# EAGLE design G2G-X Module (EAGLE 7.2.0)
Grove-to-Gadgeteer Module
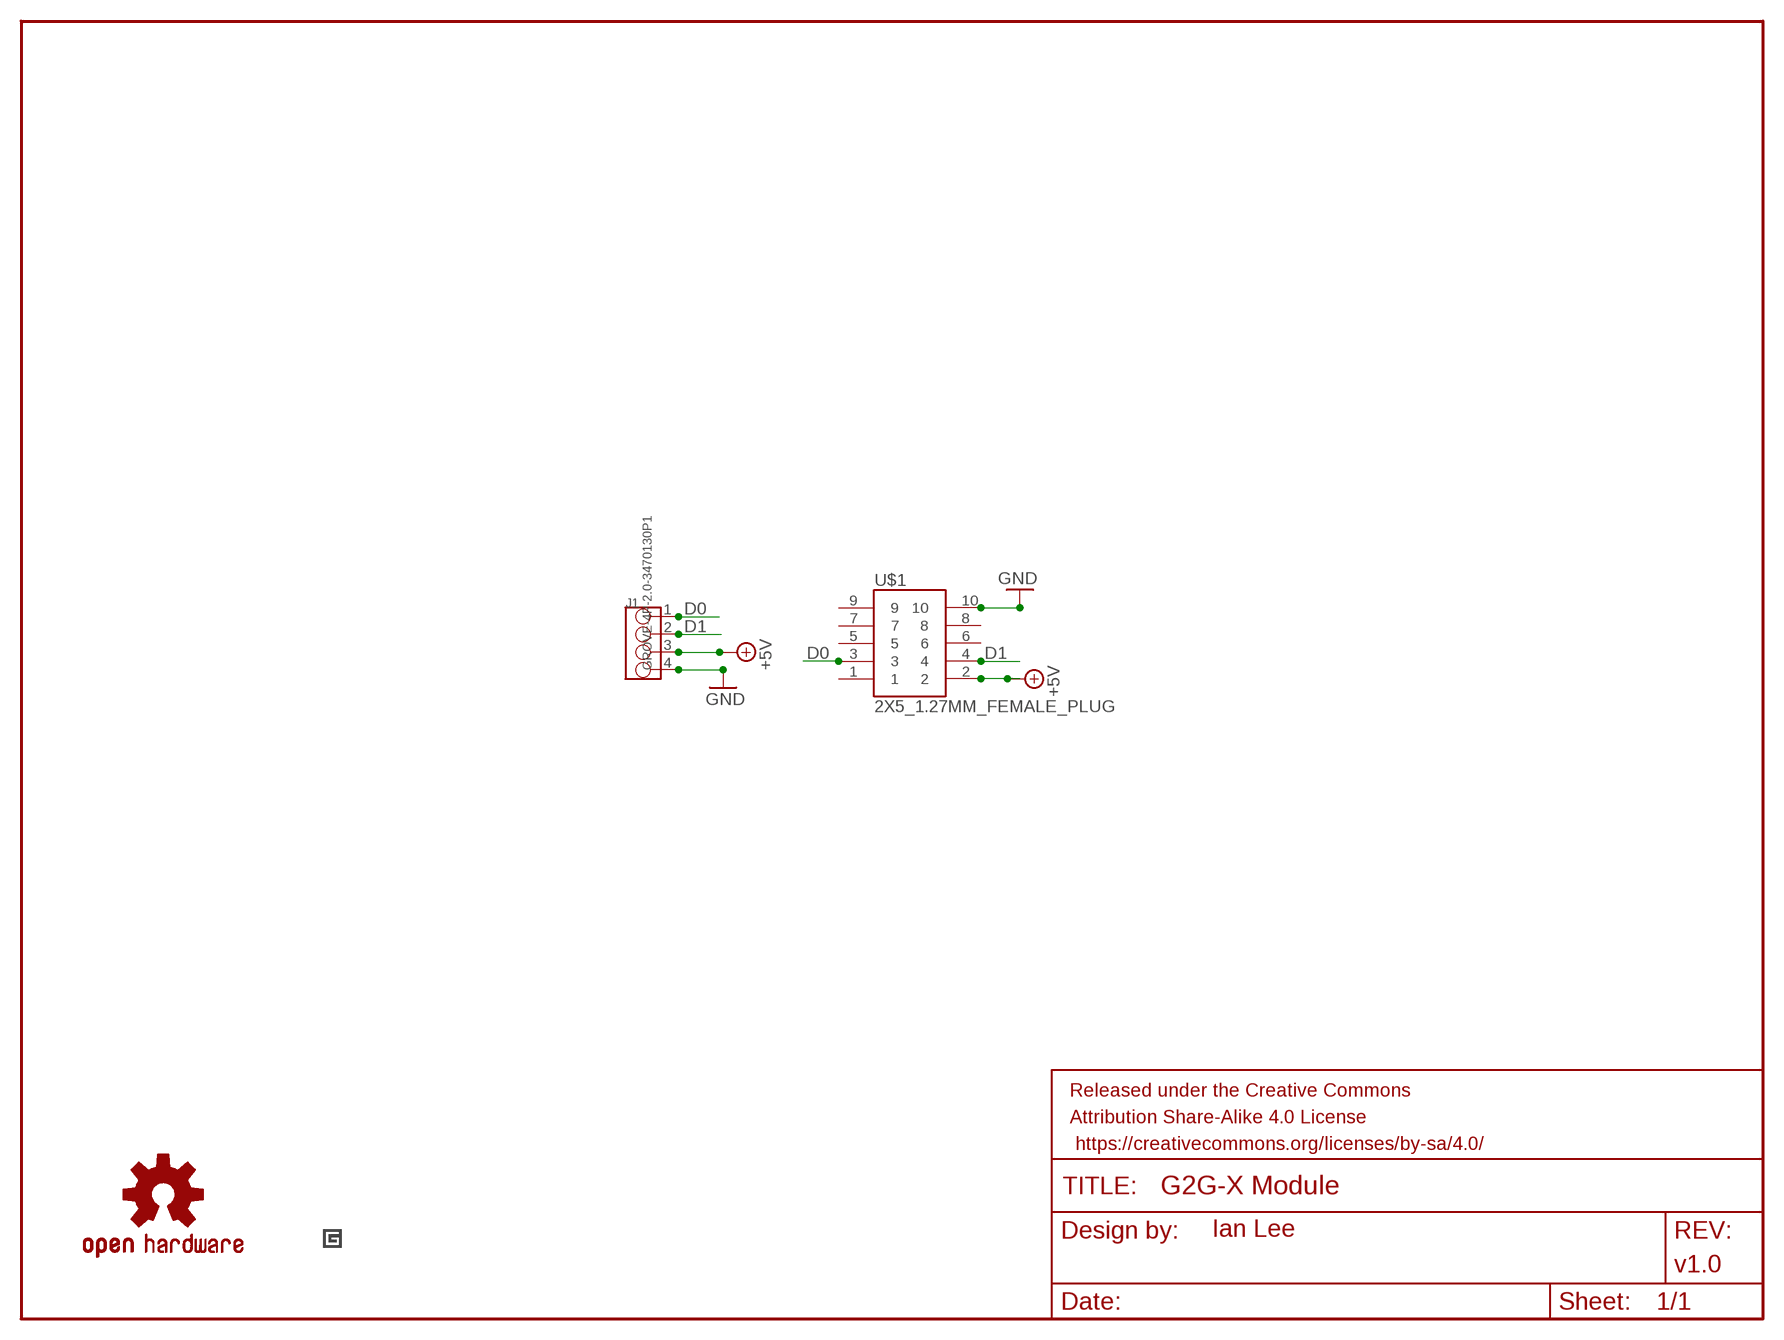
[diagram p0: schematic, sheet 1]

## Parts
FRAME1  FRAME-LETTERNO_PACKAGE  [DUMMY]
J1  GROVE-4P-2.0-3470130P1  [4P-2.0]
LOGO1  OSHW-LOGOS  [OSHW-LOGO-S]
U$1  2X5_1.27MM_FEMALE_PLUG  [2X5_1.27MM_FEMALE_PLUG]
U$2  GADGETEER_LOGO_SMALL  [GADGETEER_LOGO_SMALL]

## Nets
+5V: J1.3 U$1.2
D0: J1.1 U$1.3
D1: J1.2 U$1.4
GND: J1.4 U$1.10
Unconnected: U$1.1 U$1.5 U$1.6 U$1.7 U$1.8 U$1.9

## Library data of the parts
FRAME1 = SparkFun-Aesthetics:FRAME-LETTER: Schematic Frame Standard 8.5x11 US Letter frame; DESIGNER: Ian Lee; VERSION: v1.0
J1 = SoftDust:GROVE-4P-2.0
LOGO1 = SparkFun-Aesthetics:OSHW-LOGO: Open Source Hardware Logo This logo indicates the piece of hardware it is found on incorporates a OSHW license and/or adheres to the definition of open source hardware found here: http://freedomdefined.org/OSHW
U$1 = SoftDust:2X5_1.27MM_FEMALE_PLUG
U$2 = SoftDust:GADGETEER_LOGO_SMALL

## Board
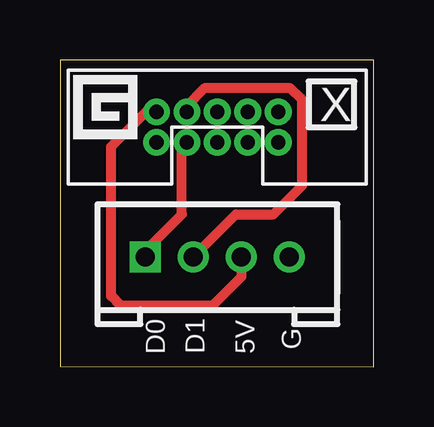
[diagram p1: board, top side]
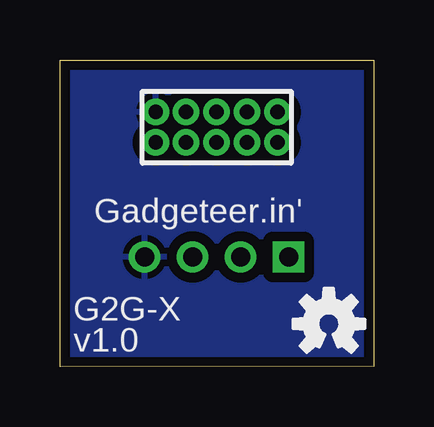
[diagram p2: board, bottom side, seen from below]

Size 13.08 x 12.8 mm. Coordinates in mm from the lower left corner, seen from the top.
Outline: 0,0.01 13.07,0 13.08,12.8 0,12.8 0,0.01
Copper layers (1*16): Top 0.035mm / dielectric 1.5mm / Bottom 0.035mm
Design rules "SeeedStudio_2layer_DRU_no_angle_20140221": minimum track width 6mil, minimum drill 12mil, track to track 6mil, track to pad 6mil, pad to pad 6mil, via to via 6mil, smd to smd 0mil, copper to edge 10mil, drill to drill 10mil, minimum pad ring 10mil, minimum via ring 6mil, stop-mask expansion 2mil, vias tented up to drill 100mil, thermal gap 10mil

### Footprints (pad centres in the part's own frame; a part is rotated, then mirrored left to right if it is on the bottom)
4P-2.0 = drill 0.8 pad 1.27 square: 1 -3,0 | drill 0.8 pad 1.27: 2 -1,0; 3 1,0; 4 3,0
2X5_1.27MM_FEMALE_PLUG = drill 0.6 pad 0.9: 1 -2.54,0.635; 2 -2.54,-0.635; 3 -1.27,0.635; 4 -1.27,-0.635; 5 0,0.635; 6 0,-0.635; 7 1.27,0.635; 8 1.27,-0.635; 9 2.54,0.635; 10 2.54,-0.635

### Placement (x,y rotation side)
FRAME1  0,-1.26 0 top
J1  6.55,4.58 0 top
LOGO1  1.88,1.79 0 bottom
U$1  6.55,9.99 180 bottom
U$2  0.56,9.51 0 top

### Tracks (layer width: path | path; a pad name or v marks a point on that pad's centre or on a via)
+5V
  Top 0.406: J1.3 7.55,3.75 6.35,2.55 2.54,2.55 2.13,2.95 2.13,9.18 3.58,10.62 U$1.2
D0
  Top 0.406: J1.1 3.55,4.83 5.08,6.36 5.08,9.15 U$1.3
D1
  Top 0.406: J1.2 7.33,6.36 8.89,6.36 10.08,7.55 10.08,11.13 9.6,11.62 6.02,11.62 5.28,10.88 U$1.4
GND
  pour Bottom (isolate 0.406): 0,0.01 13.06,0.01 13.08,0.03 13.08,12.78 13.06,12.81 0,12.81

### Text on the board
tPlace: X | D0 | D1 | 5V | G
bPlace: Gadgeteer.in' | G2G-X | v1.0